# Altium schematic sheet Schematic_page3.SchDoc
size 420 x 297 mm; Address1: Address1; Address2: Address2; Address3: Address3; Address4: Address4; DocumentNumber: АБВГ.123456.001 Э3; SheetNumber: 1; SheetTotal: 3; Scale: 1:1; DocumentType: Схема электрическая принципиальная; FirstReferrence: АБВГ.123456.001
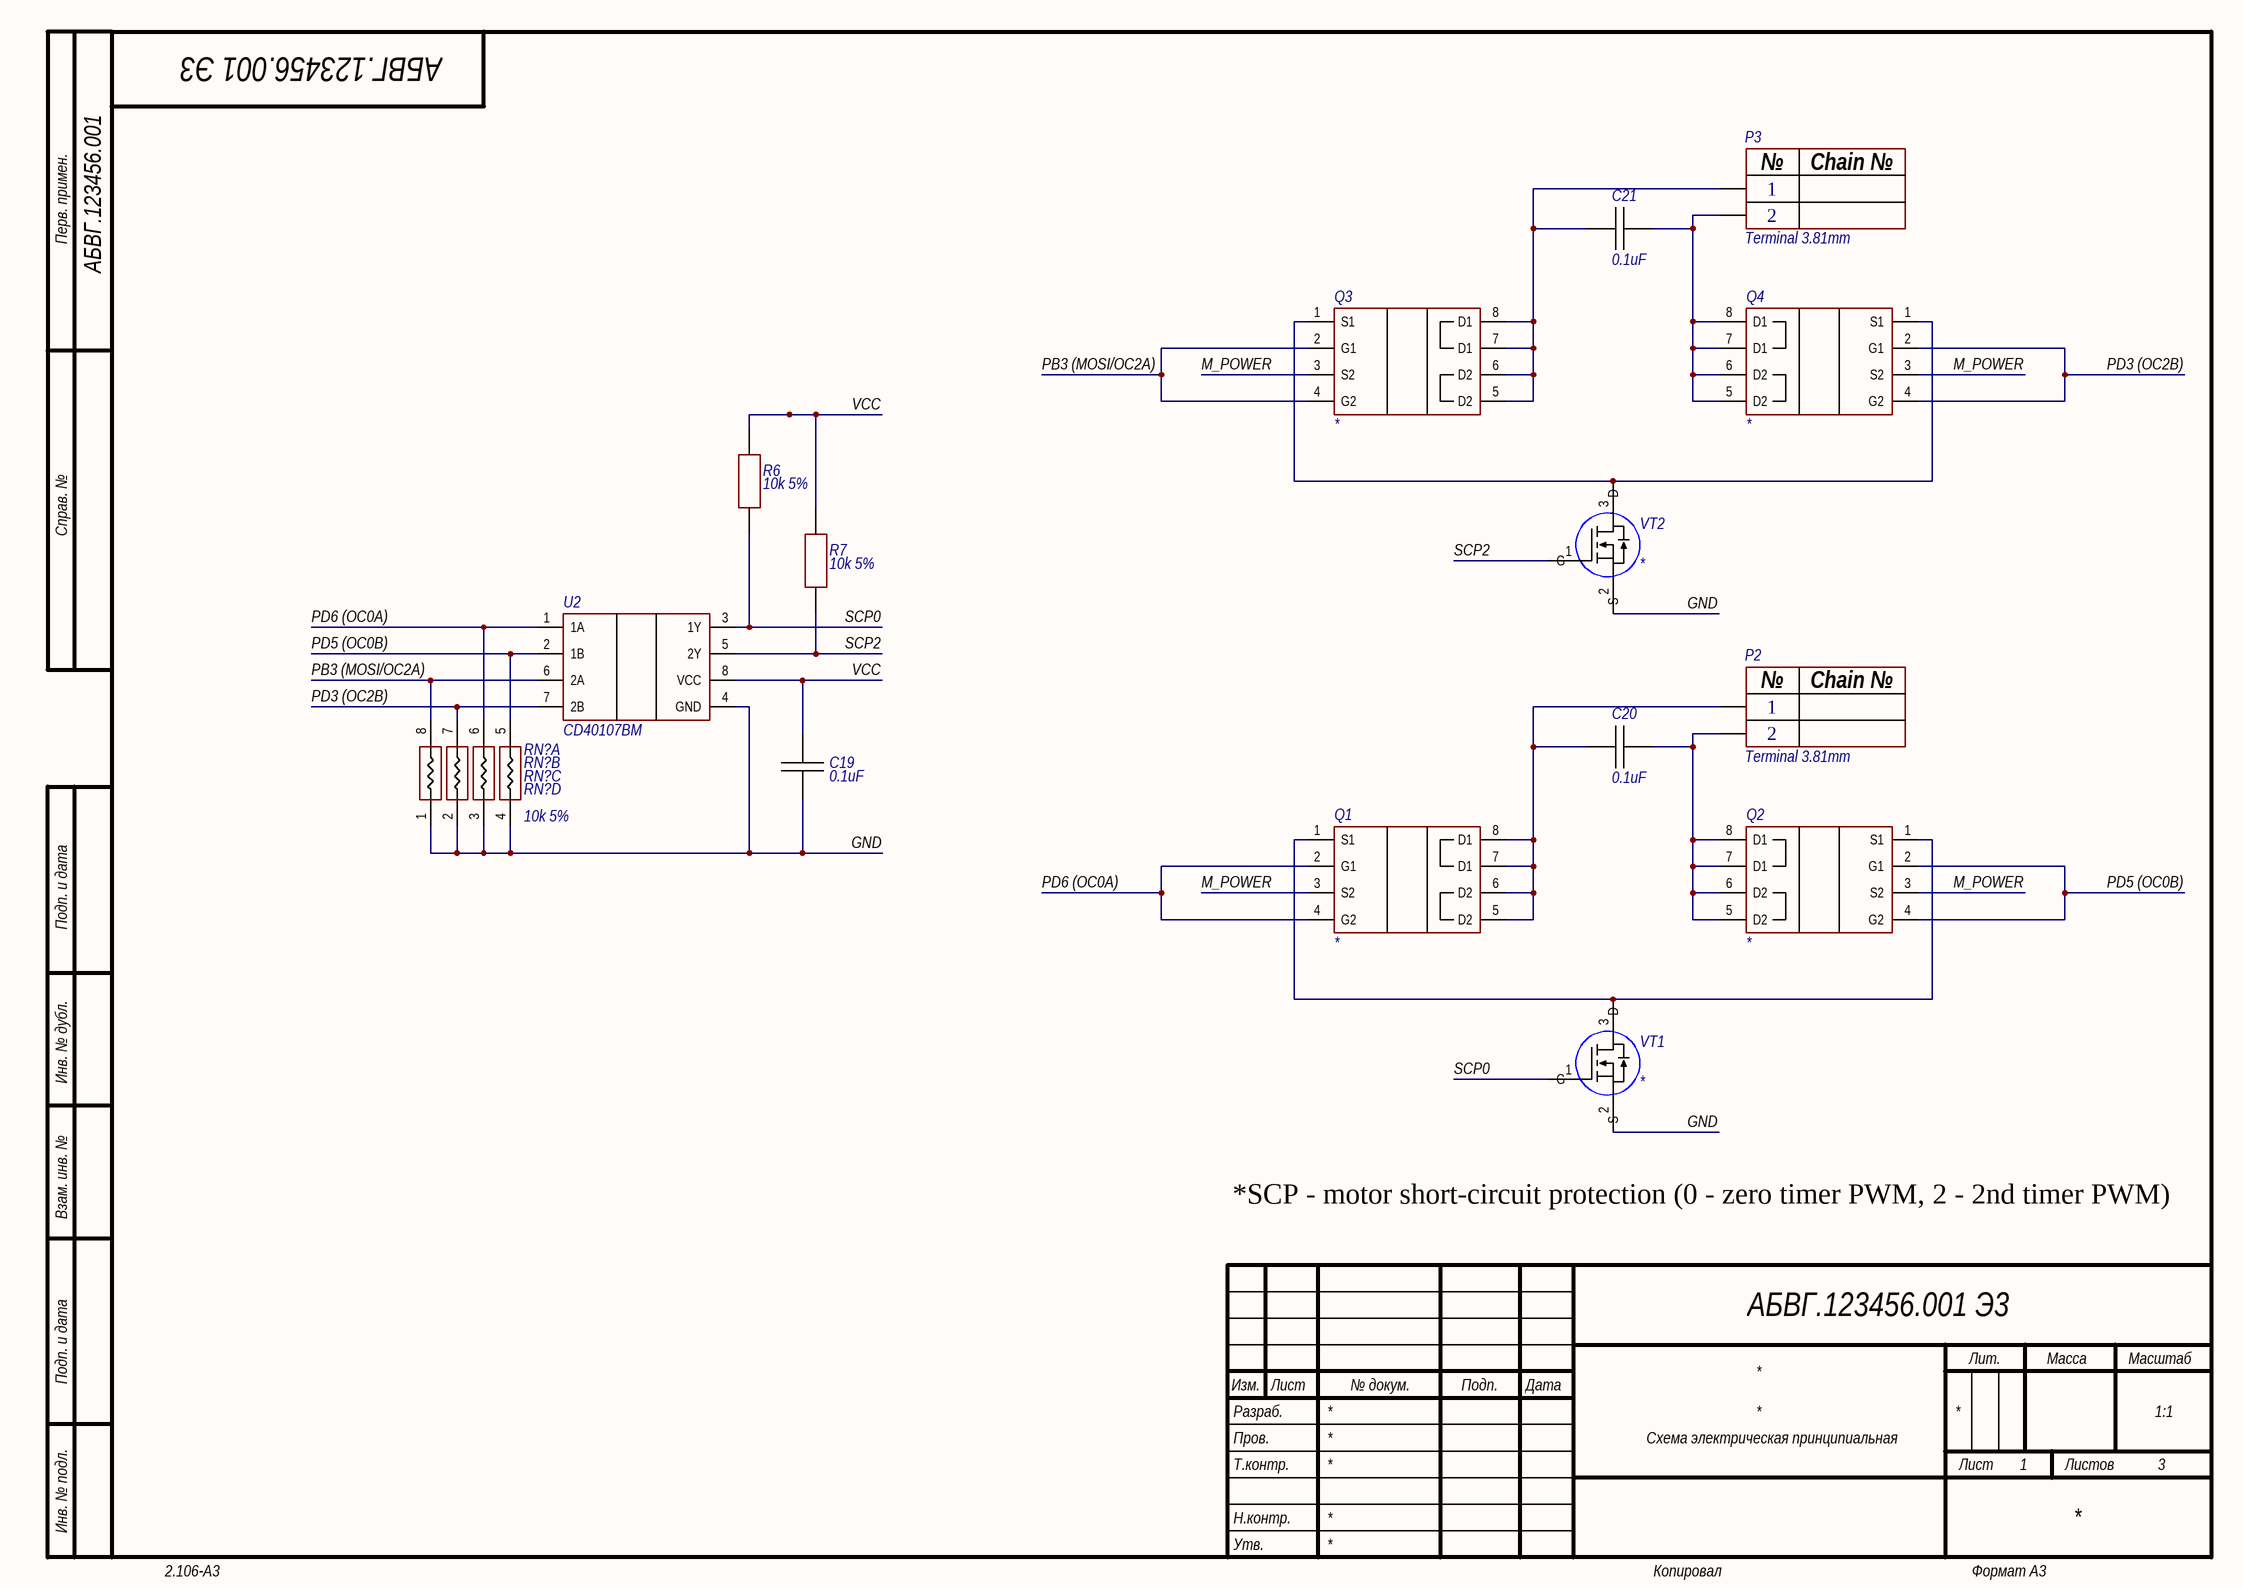
[diagram p0: Schematic_page3.SchDoc]

## Parts
(Parts that share a designator on the sheet are numbered #1, #2 ... from top to bottom, then left to right.)
C19  0.1uF  [C0603]
C20  0.1uF  [C0603]
C21  0.1uF  [C0603]
P2  Terminal 3.81mm  [Terminal 2x 3.81mm]
P3  Terminal 3.81mm  [Terminal 2x 3.81mm]
Q1  *  [SOIC-8]
Q2  *  [SOIC-8]
Q3  *  [SOIC-8]
Q4  *  [SOIC-8]
R6  10k 5%  [R0603]
R7  10k 5%  [R0603]
RN?#1  10k 5%  [RN_YC164-JR-072K2L]  (part A of 4)  (graphical)
RN?#2  10k 5%  [RN_YC164-JR-072K2L]  (value not drawn)  (part B of 4)  (graphical)
RN?#3  10k 5%  [RN_YC164-JR-072K2L]  (value not drawn)  (part C of 4)  (graphical)
RN?#4  10k 5%  [RN_YC164-JR-072K2L]  (value not drawn)  (part D of 4)  (graphical)
U2  CD40107BM  [SOIC-8]
VT1  *  [SOT-23-3]
VT2  *  [SOT-23-3]

## Nets
GND: C19.2 RN?#1.1 RN?#2.2 RN?#3.3 RN?#4.4 U2.4(GND) VT1.2(S) VT2.2(S)
M_POWER: Q1.3(S2) Q2.3(S2) Q3.3(S2) Q4.3(S2)
PB3 (MOSI/OC2A): Q3.2(G1) Q3.4(G2) RN?#1.8 U2.6(2A)
PD3 (OC2B): Q4.2(G1) Q4.4(G2) RN?#2.7 U2.7(2B)
PD5 (OC0B): Q2.2(G1) Q2.4(G2) RN?#4.5 U2.2(1B)
PD6 (OC0A): Q1.2(G1) Q1.4(G2) RN?#3.6 U2.1(1A)
SCP0: R6.2 U2.3(1Y) VT1.1(G)
SCP2: R7.2 U2.5(2Y) VT2.1(G)
VCC: C19.1 R6.1 R7.1 U2.8(VCC)
NetC20_1: C20.1 P2.2 Q2.5(D2) Q2.6(D2) Q2.7(D1) Q2.8(D1)
NetC20_2: C20.2 P2.1 Q1.5(D2) Q1.6(D2) Q1.7(D1) Q1.8(D1)
NetC21_1: C21.1 P3.2 Q4.5(D2) Q4.6(D2) Q4.7(D1) Q4.8(D1)
NetC21_2: C21.2 P3.1 Q3.5(D2) Q3.6(D2) Q3.7(D1) Q3.8(D1)
NetQ1_1: Q1.1(S1) Q2.1(S1) VT1.3(D)
NetQ3_1: Q3.1(S1) Q4.1(S1) VT2.3(D)

## Notes on the sheet
- (near P3) 1
- (near P3) 2
- (near P2) 1
- (near P2) 2
- *SCP - motor short-circuit protection (0 - zero timer PWM, 2 - 2nd timer PWM)
- Перв. примен.
- Справ. №
- Подп. и дата
- Инв. № дубл.
- Взам. инв. №
- Разраб.
- Изм.
- Лист
- № докум.
- Подп.
- Дата
- Лит.
- Масса
- Масштаб
- Пров.
- Т.контр.
- Листов
- Инв. № подл.
- Утв.
- Н.контр.
- 2.106-A3
- Копировал
- Формат А3
- (in symbol Terminal 3.81mm) №; Chain №

## Library data of the parts
C19-C21 = Capasitor: Value: 0.1uF; Case: *; Manufacturer: *; HelpURL: *; Model: *
Q1-Q4 = IRF7307: Mosfet Array N and P-Channel 20V 5.2A, 4.3A 2W Surface Mount 8-SO; Manufacturer: Infineon Technologies; Model: *; HelpURL: https://www.digikey.com/product-detail/en/infineon-technologies/IRF7307TRPBF/IRF7307PBFCT-ND/812597; Case: SOIC-8
R6 R7 = Resistor: Model: *; Value: 10k 5%; HelpURL: *; Case: *; Manufacturer: *
RN?#1-RN?#4 = Resistor Network: Manufacturer: Bourns; Model: CAT16-103J4; Value: 10k 5%; HelpURL: https://www.chipdip.by/product/cat16-103j4; Case: R0603x4
U2 = CD40107BM: NAND Gate IC 2 Channel Open Drain 8-SOIC; Manufacturer: Texas Instruments; Model: CD40107BM; HelpURL: https://www.chipdip.by/product/cd40107bm; Case: SOIC-8
VT1 VT2 = IRLML6344TRPBF: N-Channel 30V 5A (Ta) 1.3W (Ta) Surface Mount Micro3™/SOT-23; Manufacturer: Infineon Technologies; Case: SOT-23-3; HelpURL: https://www.digikey.com/product-detail/en/infineon-technologies/IRLML6344TRPBF/IRLML6344TRPBFCT-ND/2538168; Model: *
P2 P3 = Terminal 3.81mm: Manufacturer: *; HelpURL: *; Model: *; Case: *